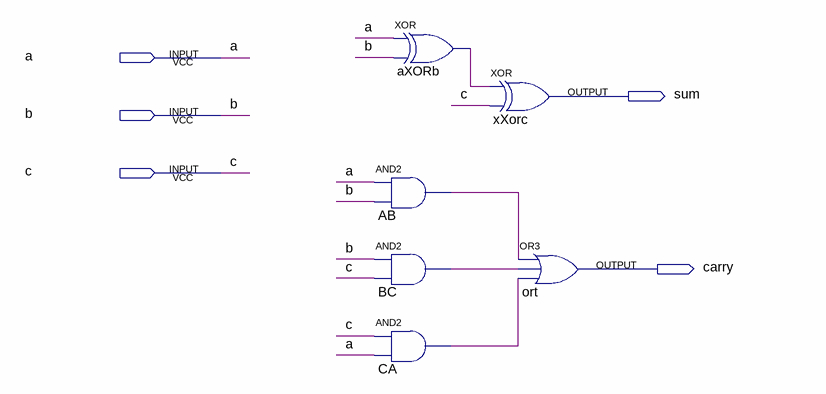
[diagram p0: schematic sheet]
// Quartus schematic FA.bdf as structural Verilog: 6 symbols, 5 pins
module FA (
  input  a,
  input  b,
  input  c,
  output sum,
  output carry
);

  wire AB_out, aXORb_out, BC_out, CA_out;

  xor aXORb (aXORb_out, a, b);
  and AB (AB_out, a, b);
  and BC (BC_out, b, c);
  and CA (CA_out, c, a);
  xor xXorc (sum, aXORb_out, c);
  or ort (carry, AB_out, BC_out, CA_out);
endmodule
